# EAGLE design InternetRadio (EAGLE 7.7.0)
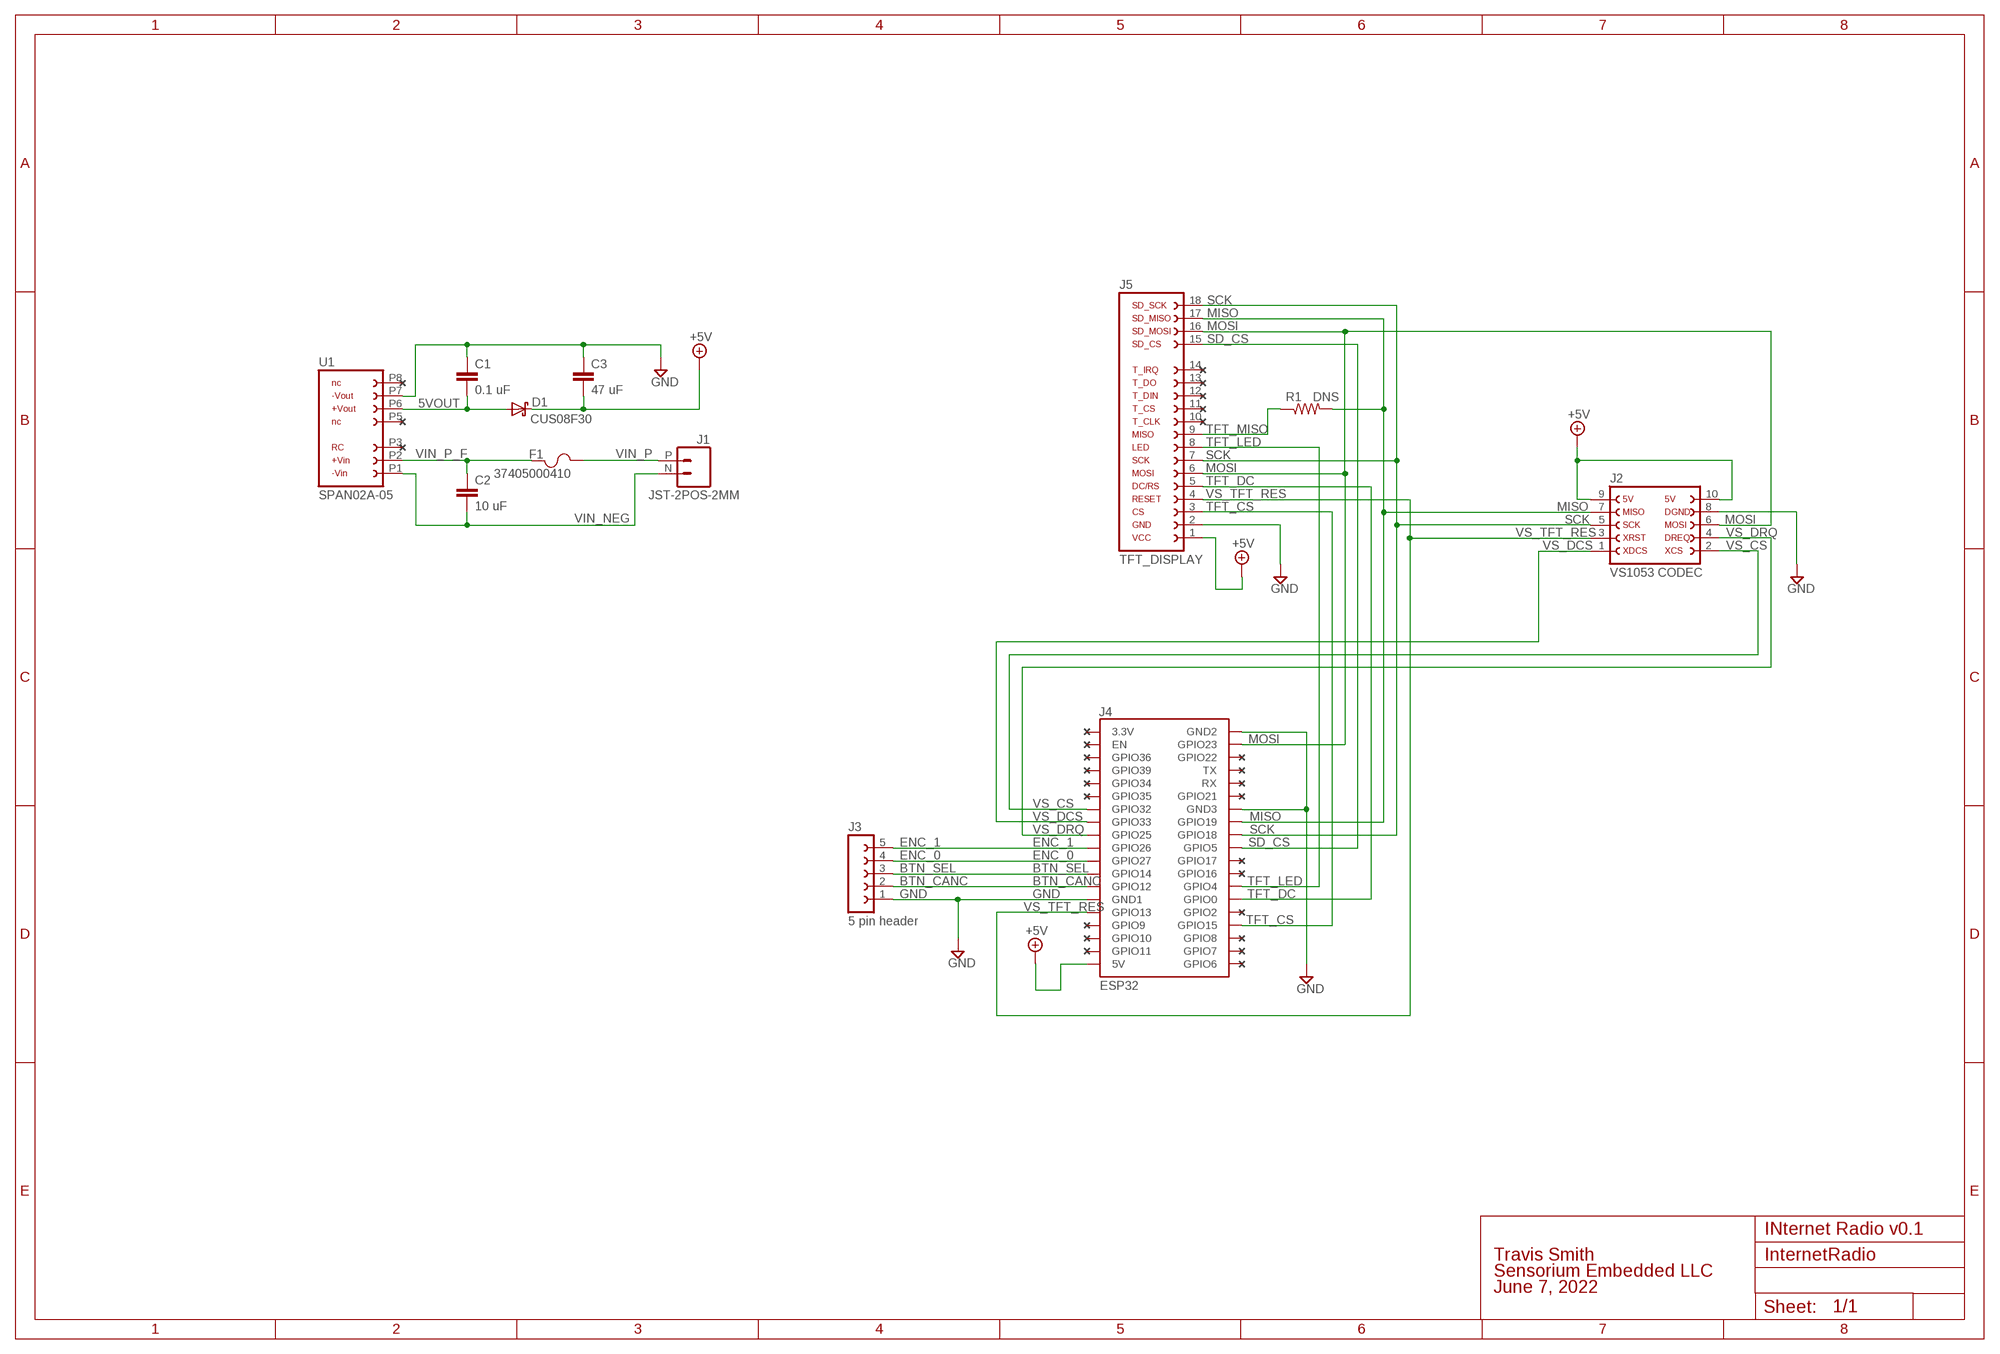
[diagram p0: schematic, sheet 1]

## Parts
C1  0.1 uF  CAP-0805-1UF-25V  [0805]
C2  10 uF  CAP-0805-1UF-25V  [0805]
C3  47 uF  CAP-0805-1UF-25V  [0805]
D1  CUS08F30  SCHOTTKY_CUS08F30  [SOD-323]
F1  37405000410  [FUS_LITTELFUSE_374_LTF]
J1  JST-2POS-2MM  JST-2POS_2MM  [89400-0220]
J2  VS1053 CODEC  VS1053_MODULE  [VS1053_MODULE]
J3  5 pin header  FE05-1  [FE05-1]
J4  ESP32  [ESP32]
J5  TFT_DISPLAY  3.5"_TFT_DISPLAY  [3.5"_TFT_DISPLAY-NO_HOLES]
R1  DNS  RESISTOR-0805-DNS  [0805]
U1  SPAN02A-05  [SPAN02A-05]

## Nets
5VOUT: C1.2 D1.A U1.P6
+5V: C3.2 D1.C J2.9 J2.10 J4.5V J5.1
BTN_CANC: J3.2 J4.GPIO12
BTN_SEL: J3.3 J4.GPIO14
ENC_0: J3.4 J4.GPIO27
ENC_1: J3.5 J4.GPIO26
GND: C1.1 C3.1 J2.8 J3.1 J4.GND1 J4.GND2 J4.GND3 J5.2 U1.P7
MISO: J2.7 J4.GPIO19 J5.17 R1.2
MOSI: J2.6 J4.GPIO23 J5.6 J5.16
SCK: J2.5 J4.GPIO18 J5.7 J5.18
SD_CS: J4.GPIO5 J5.15
TFT_CS: J4.GPIO15 J5.3
TFT_DC: J4.GPIO0 J5.5
TFT_LED: J4.GPIO4 J5.8
TFT_MISO: J5.9 R1.1
VIN_NEG: C2.2 J1.N U1.P1
VIN_P: F1.1 J1.P
VIN_P_F: C2.1 F1.2 U1.P2
VS_CS: J2.2 J4.GPIO32
VS_DCS: J2.1 J4.GPIO33
VS_DRQ: J2.4 J4.GPIO25
VS_TFT_RES: J2.3 J4.GPIO13 J5.4
Unconnected: J4.3.3V J4.EN J4.GPIO2 J4.GPIO6 J4.GPIO7 J4.GPIO8 J4.GPIO9 J4.GPIO10 J4.GPIO11 J4.GPIO16 J4.GPIO17 J4.GPIO21 J4.GPIO22 J4.GPIO34 J4.GPIO35 J4.GPIO36 J4.GPIO39 J4.RX J4.TX J5.10 J5.11 J5.12 J5.13 J5.14 U1.P3 U1.P5 U1.P8

## Library data of the parts
C1-C3 = cap:CAP-0805-: Cap, 0805; DIGIKEY: 1276-6469-2-ND; MANUF1: Samsung Electro-Mechanics; MPN1: CL21B105KAFNNNG; VALUE: 1 uF
D1 = InternetRadio:SCHOTTKY_CUS08F30: DIODE SCHOTTKY 30V 800MA USC; DIGIKEY: CUS08F30H3FTR-ND; MANUF1: Toshiba; MPN1: CUS08F30,H3F
F1 = InternetRadio:37405000410; COPYRIGHT: Copyright (C) 2022 Ultra Librarian. All rights reserved.; DIGI-KEY_PART_NUMBER_1: WK4041BK-ND; MANUFACTURER_PART_NUMBER: 37405000410; MFR_NAME: Littelfuse Inc
J1 = InternetRadio:JST-2POS_2MM: CONN HEADER VERT 2POS 2MM; DIGIKEY: 455-1704-ND; MANUF1: JST Sales America Inc.; MPN1: B2B-PH-K-S(LF)(SN)
J2 = InternetRadio:VS1053_MODULE: MP3 Decoder; OC_FARNELL: unknown; OC_NEWARK: unknown
J3 = InternetRadio:FE05-1: FEMALE HEADER; OC_FARNELL: unknown; OC_NEWARK: unknown
J4 = InternetRadio:ESP32
J5 = InternetRadio:3.5"_TFT_DISPLAY
R1 = InternetRadio:RESISTOR-0805-: Resistor, 0805
U1 = InternetRadio:SPAN02A-05

## Net classes
3 pwr: width 0.508 mm, clearance 0.178 mm to class 0, clearance 0.762 mm to class 1, clearance 0.711 mm to class 2, clearance 0.203 mm

## Board
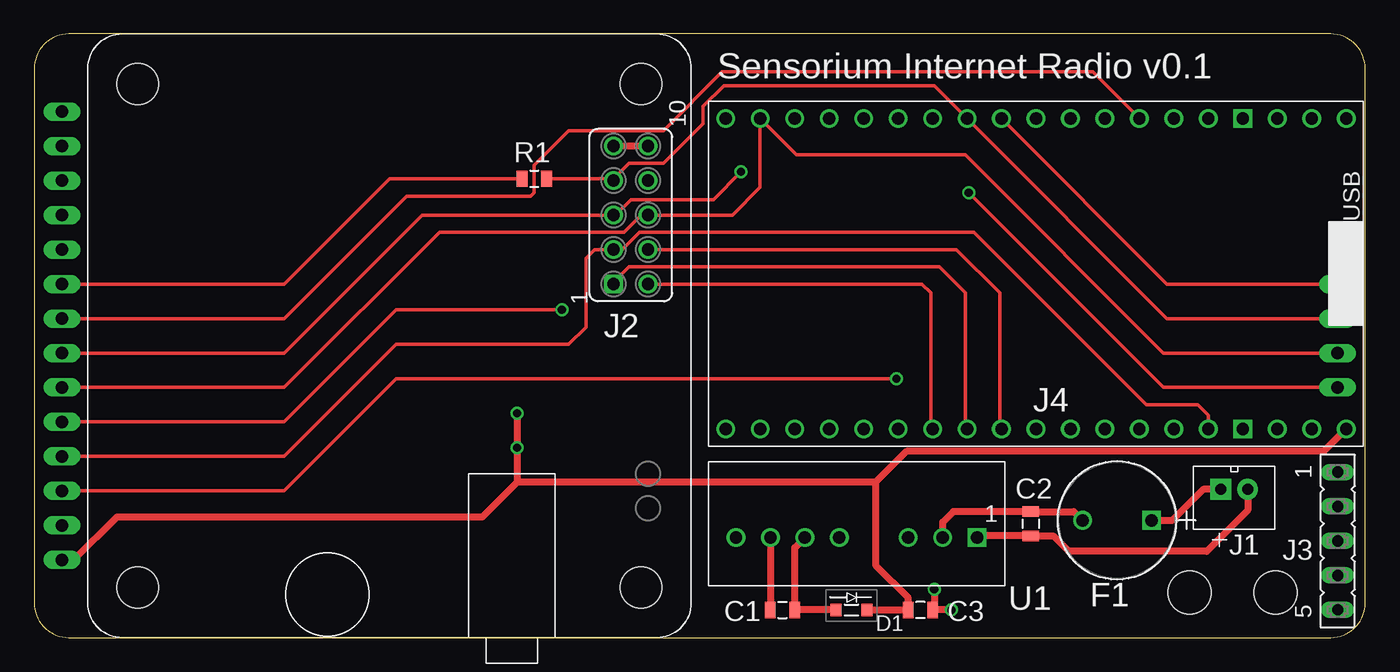
[diagram p1: board, top side]
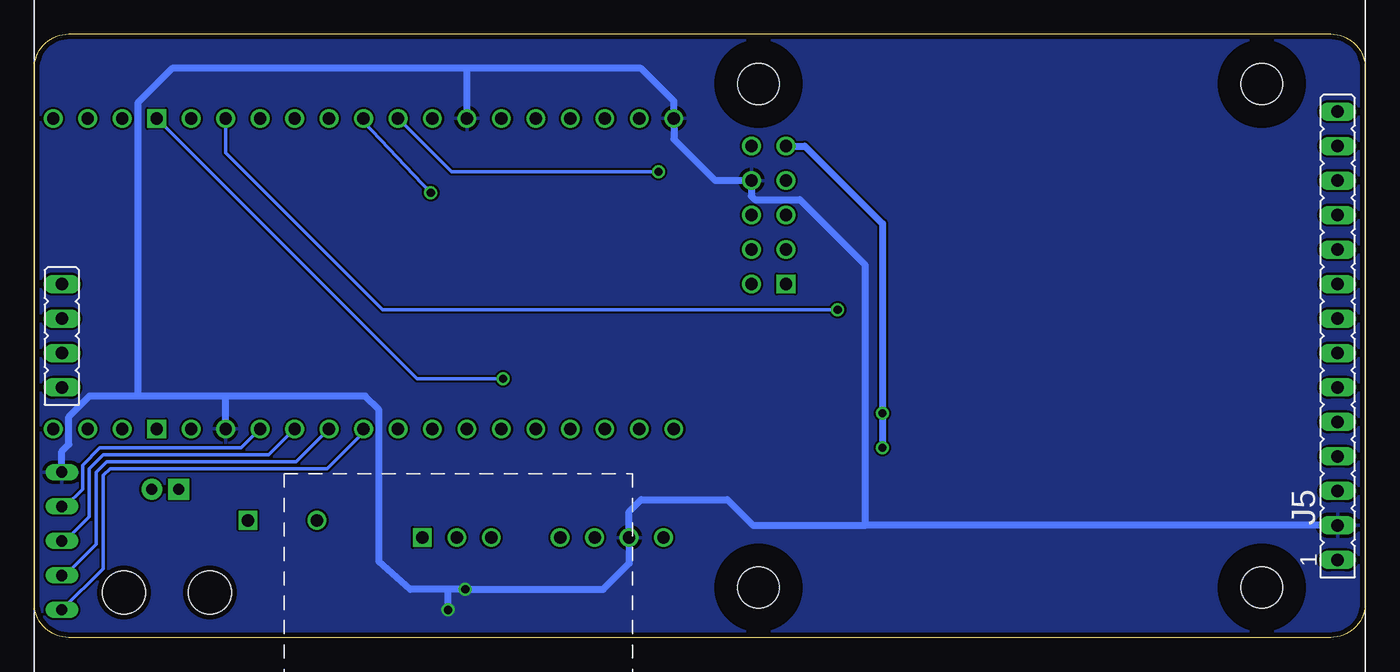
[diagram p2: board, bottom side, seen from below]

Size 98.04 x 44.45 mm. Coordinates in mm from the lower left corner, seen from the top.
Outline: 0,41.91 0,2.54 arc90 2.54,0 95.5,0 arc90 98.04,2.54 98.04,41.91 arc90 95.5,44.45 2.54,44.45 arc90 0,41.91
Copper layers (1*16): Top 0.0356mm / dielectric 1.5011mm / Bottom 0.0356mm
Design rules "oshpark-2layer *": minimum track width 6mil, minimum drill 13mil, track to track 6mil, track to pad 6mil, pad to pad 6mil, via to via 6mil, smd to smd 6mil, copper to edge 15mil, drill to drill 6mil, minimum pad ring 7mil, minimum via ring 7mil, stop-mask expansion 2.5mil, vias tented up to drill 25mil, thermal gap 10mil
Holes 3.17 mm at 91.44,3.3 85.09,3.3

### Footprints (pad centres in the part's own frame; a part is rotated, then mirrored left to right if it is on the bottom)
0805 = smd 0.8 x 1.2: 1 -0.9,0; 2 0.9,0
SOD-323 = smd 0.8 x 0.9: A -1.15,0; C 1.15,0
FUS_LITTELFUSE_374_LTF = drill 0.914 square: 1 -2.54,0 | drill 0.914: 2 2.54,0
89400-0220 = drill 0.8 pad 1.524: N 0.991,0 | drill 0.8 pad 1.524 square: P -0.991,0
VS1053_MODULE = drill 0.914 square: 1 -3.81,16.51 | drill 0.914: 2 -3.81,19.05; 3 -6.35,16.51; 4 -6.35,19.05; 5 -8.89,16.51; 6 -8.89,19.05; 7 -11.43,16.51; 8 -11.43,19.05; 9 -13.97,16.51; 10 -13.97,19.05 | hole 3.048: -18.542,18.542; -18.542,-18.542; 18.542,18.542; 18.542,-18.542
FE05-1 = drill 0.813 long: 1 -5.08,0; 2 -2.54,0; 3 0,0; 4 2.54,0; 5 5.08,0
ESP32 = drill 0.914: 3.3V -11.43,21.59; 5V -11.43,-24.13; EN -11.43,19.05; GND1 -11.43,-11.43; GND2 11.43,21.59; GND3 11.43,6.35; GPIO0 11.43,-11.43; GPIO2 11.43,-13.97; GPIO4 11.43,-8.89; GPIO5 11.43,-1.27; GPIO6 11.43,-24.13; GPIO7 11.43,-21.59; GPIO8 11.43,-19.05; GPIO10 -11.43,-19.05; GPIO11 -11.43,-21.59; GPIO12 -11.43,-8.89; GPIO13 -11.43,-13.97; GPIO14 -11.43,-6.35; GPIO16 11.43,-6.35; GPIO17 11.43,-3.81; GPIO18 11.43,1.27; GPIO19 11.43,3.81; GPIO21 11.43,8.89; GPIO22 11.43,16.51; GPIO23 11.43,19.05; GPIO25 -11.43,1.27; GPIO26 -11.43,-1.27; GPIO27 -11.43,-3.81; GPIO32 -11.43,6.35; GPIO33 -11.43,3.81; GPIO34 -11.43,11.43; GPIO35 -11.43,8.89; GPIO36 -11.43,16.51; GPIO39 -11.43,13.97; RX 11.43,11.43; TX 11.43,13.97 | drill 0.914 square: GPIO9 -11.43,-16.51; GPIO15 11.43,-16.51
3.5"_TFT_DISPLAY-NO_HOLES = drill 0.914 long: 1 46.99,-16.51; 2 46.99,-13.97; 3 46.99,-11.43; 4 46.99,-8.89; 5 46.99,-6.35; 6 46.99,-3.81; 7 46.99,-1.27; 8 46.99,1.27; 9 46.99,3.81; 10 46.99,6.35; 11 46.99,8.89; 12 46.99,11.43; 13 46.99,13.97; 14 46.99,16.51; 15 -46.99,-3.81; 16 -46.99,-1.27; 17 -46.99,1.27; 18 -46.99,3.81
SPAN02A-05 = drill 0.914 square: P1 -8.763,1.778 | drill 0.914: P2 -6.223,1.778; P3 -3.683,1.778; P5 1.397,1.778; P6 3.937,1.778; P7 6.477,1.778; P8 9.017,1.778

### Placement (x,y rotation side)
C1  55.12,2.03 0 top
C2  73.41,8.38 270 top
C3  65.28,2.03 180 top
D1  60.2,2.03 0 top
F1  79.76,8.64 180 top
J1  88.39,10.92 0 top
J2  26.16,22.23 270 top
J3  96.01,7.11 270 top
J4  72.52,26.8 90 top
J5  49.02,22.23 0 bottom
R1  36.83,33.78 0 top
U1  60.71,9.14 180 top

### Tracks (layer width: path | path; a pad name or v marks a point on that pad's centre or on a via)
5VOUT
  Top 0.508: U1.P6 56.02,6.62 C1.2 D1.A
+5V  (via drill 0.6)
  Top 0.508: J5.1 2.92,5.71 6.1,8.89 33.02,8.89 35.56,11.43 | J2.10 J2.9 | D1.C C3.2 64.38,2.93 61.98,5.33 61.98,11.43 | J4.5V 95,13.72 64.26,13.72 61.98,11.43 | 35.56,11.43 v35.56,13.97 v35.56,16.51 | 61.98,11.43 35.56,11.43
  Bottom 0.508: J2.9 41.27,36.2 35.56,30.48 v35.56,13.97
BTN_CANC
  Bottom 0.254: J3.2 95.76,9.65 94.49,10.92 94.49,12.7 93.22,13.97 82.8,13.97 J4.GPIO12
BTN_SEL
  Bottom 0.254: J3.3 95.76,7.11 93.98,8.89 93.98,12.45 92.96,13.46 80.77,13.46 J4.GPIO14
ENC_0
  Bottom 0.254: J4.GPIO27 78.74,12.95 81.28,12.95 82.3,12.95 92.71,12.95 93.47,12.19 93.47,6.86 95.76,4.57 J3.4
ENC_1
  Bottom 0.254: J4.GPIO26 73.79,15.11 76.45,12.45 92.46,12.45 92.96,11.94 92.96,5.08 J3.5
GND  (via drill 0.6)
  Top 0.508: U1.P7 54.23,2.04 C1.1 | v67.56,2.03 C3.1 | v66.29,3.56 66.29,2.54
  Bottom 0.508: 66.04,41.91 53.34,41.91 50.93,39.5 J4.GND2 50.93,36.7 47.88,33.66 J2.8 45.21,32.51 44.96,32.26 41.66,32.26 36.83,27.43 36.83,8.26 | 66.04,41.91 87.88,41.91 90.42,39.37 90.42,18.03 | J5.2 36.83,8.26 | J3.1 96.01,13.72 95.5,14.22 95.5,16.26 93.98,17.78 83.82,17.78 | 67.56,3.56 v66.29,3.56 56.13,3.56 54.23,5.46 U1.P7 54.23,9.27 53.34,10.16 46.99,10.16 45.09,8.26 36.83,8.26 | 67.56,3.56 70.36,3.56 72.64,5.59 72.64,16.76 73.66,17.78 83.82,17.78 | J4.GND3 66.17,41.78 66.04,41.91 | J4.GND1 83.95,17.65 83.82,17.78 | v67.56,2.03 67.56,3.56
  pour Bottom: 0,0 0,44.45 98.04,44.45 98.04,0
MISO
  Top 0.254: J5.17 83.44,23.5 J4.GPIO19 66.29,40.64 50.8,40.64 49.28,39.12 49.28,37.85 46.35,34.92 43.81,34.92 42.67,33.78 J2.7 42.55,33.78 R1.2
MOSI
  Top 0.254: J5.6 18.41,18.41 29.84,29.84 43.43,29.84 44.7,31.11 J2.6 51.44,31.11 53.47,33.15 J4.GPIO23 56.13,35.56 68.58,35.56 83.19,20.95 J5.16
SCK  (via drill 0.6)
  Top 0.254: J5.7 18.41,20.95 28.57,31.11 J2.5 42.8,31.11 43.94,32.26 50.04,32.26 v52.07,34.29 | J5.18 83.44,26.04 J4.GPIO18
  Bottom 0.254: J4.GPIO18 67.31,34.29 v52.07,34.29
SD_CS  (via drill 0.6)
  Top 0.254: J5.15 83.19,18.41 v68.83,32.77
  Bottom 0.254: J4.GPIO5 73.79,37.97 v68.83,32.77
TFT_CS  (via drill 0.6)
  Top 0.254: J5.3 18.41,10.79 26.67,19.05 v63.5,19.05
  Bottom 0.254: J4.GPIO15 69.85,19.05 v63.5,19.05
TFT_DC  (via drill 0.6)
  Top 0.254: J5.5 18.41,15.88 26.67,24.13 v38.86,24.13
  Bottom 0.254: v38.86,24.13 72.39,24.13 83.95,35.69 J4.GPIO0
TFT_LED
  Top 0.254: J5.8 18.41,23.5 27.43,32.51 36.58,32.51 36.83,32.77 36.83,34.8 39.37,37.34 46.35,37.34 50.67,41.66 77.98,41.66 J4.GPIO4
TFT_MISO
  Top 0.254: J5.9 18.41,26.04 26.16,33.78 R1.1
VIN_NEG
  Top 0.508: U1.P1 69.58,7.48 C2.2 75.07,7.48 76.2,6.35 86.36,6.35 89.38,9.37 J1.N
VIN_P
  Top 0.508: J1.P 86.11,10.92 83.82,8.64 F1.1
VIN_P_F
  Top 0.508: F1.2 76.57,9.28 C2.1 67.7,9.28 66.93,8.51 U1.P2
VS_CS
  Top 0.254: J2.2 65.41,26.04 66.04,25.4 66.04,15.49 J4.GPIO32
VS_DCS
  Top 0.254: J2.1 42.67,26.16 43.81,27.3 66.67,27.3 68.58,25.4 68.58,15.49 J4.GPIO33
VS_DRQ
  Top 0.254: J2.4 67.94,28.57 71.12,25.4 71.12,15.49 J4.GPIO25
VS_TFT_RES
  Top 0.254: J5.4 18.41,13.34 26.67,21.59 39.37,21.59 40.64,22.86 40.64,27.94 41.27,28.57 J2.3 43.31,28.57 44.58,29.84 69.22,29.84 81.92,17.14 85.72,17.14 86.49,16.38 J4.GPIO13

### Text on the board
tPlace: Sensorium Internet Radio v0.1